# EasyEDA Pro project STM32空调遥控器.eprj, board PCB_V0.1.0
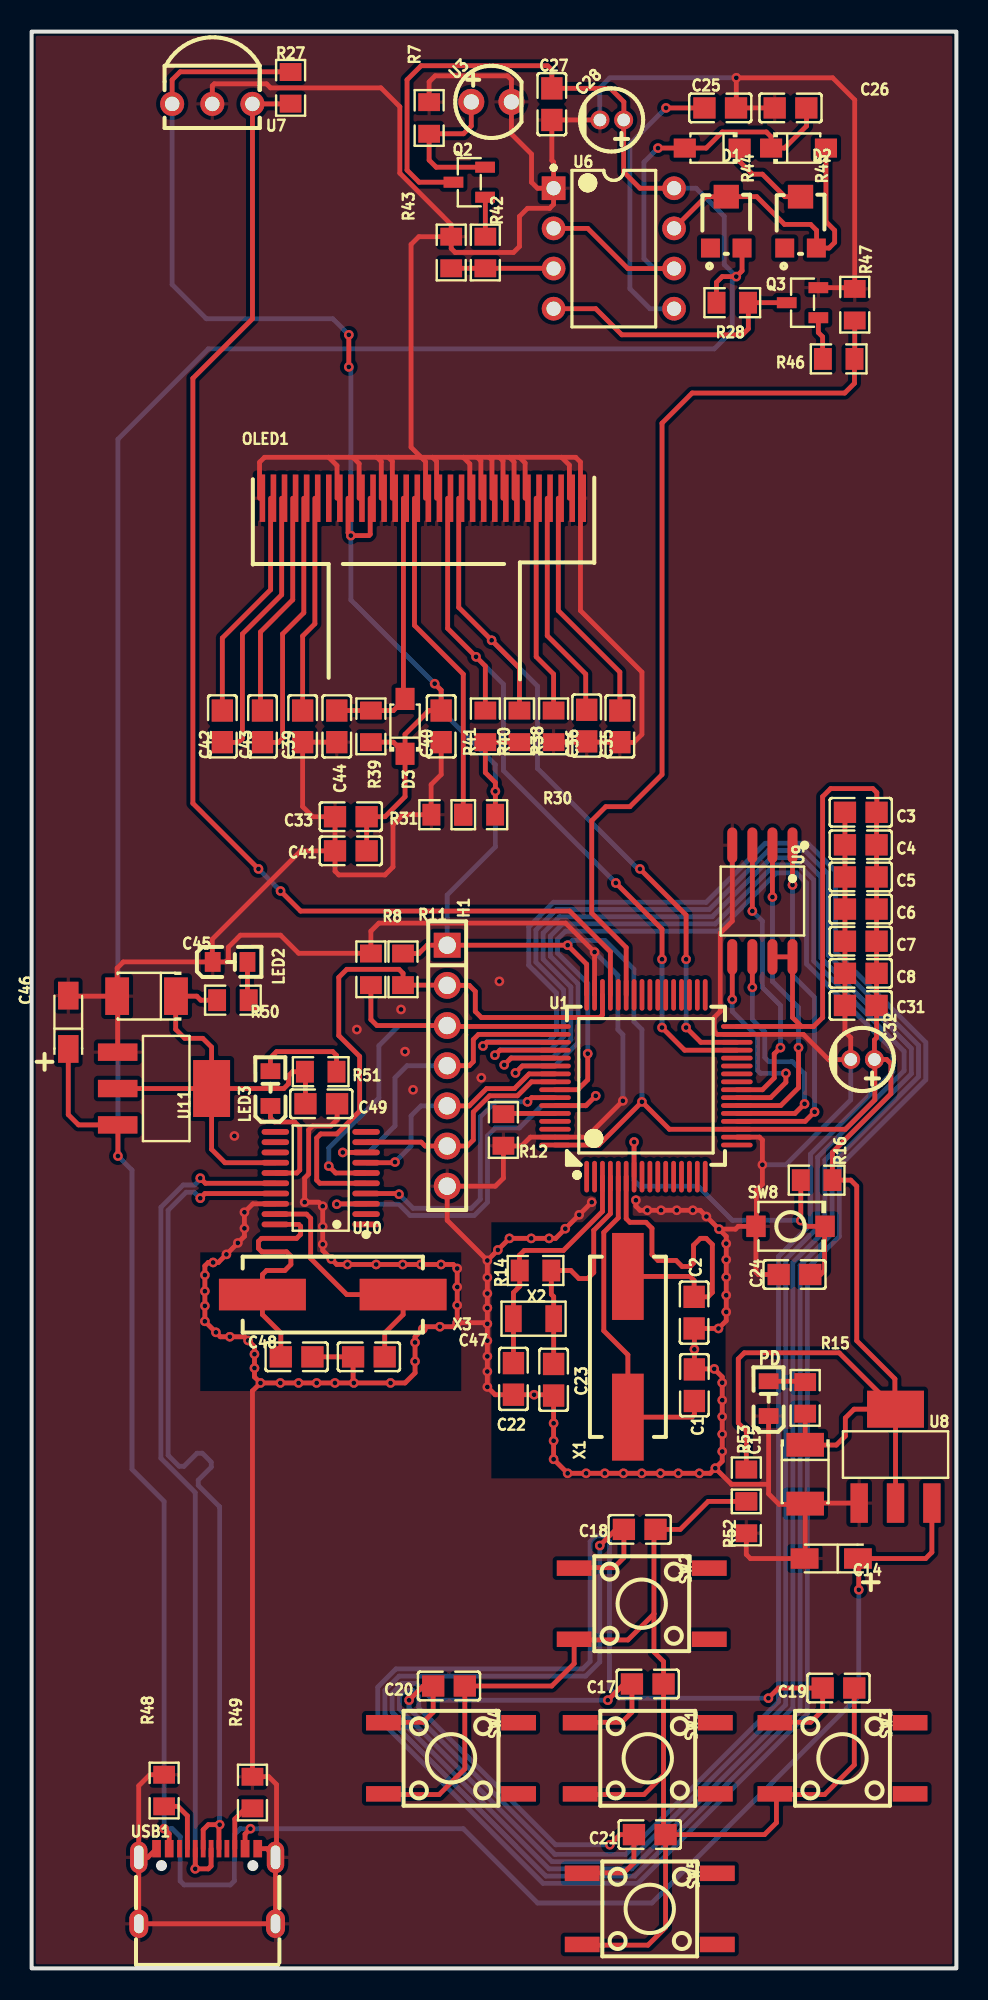
[diagram p5: board, top side]
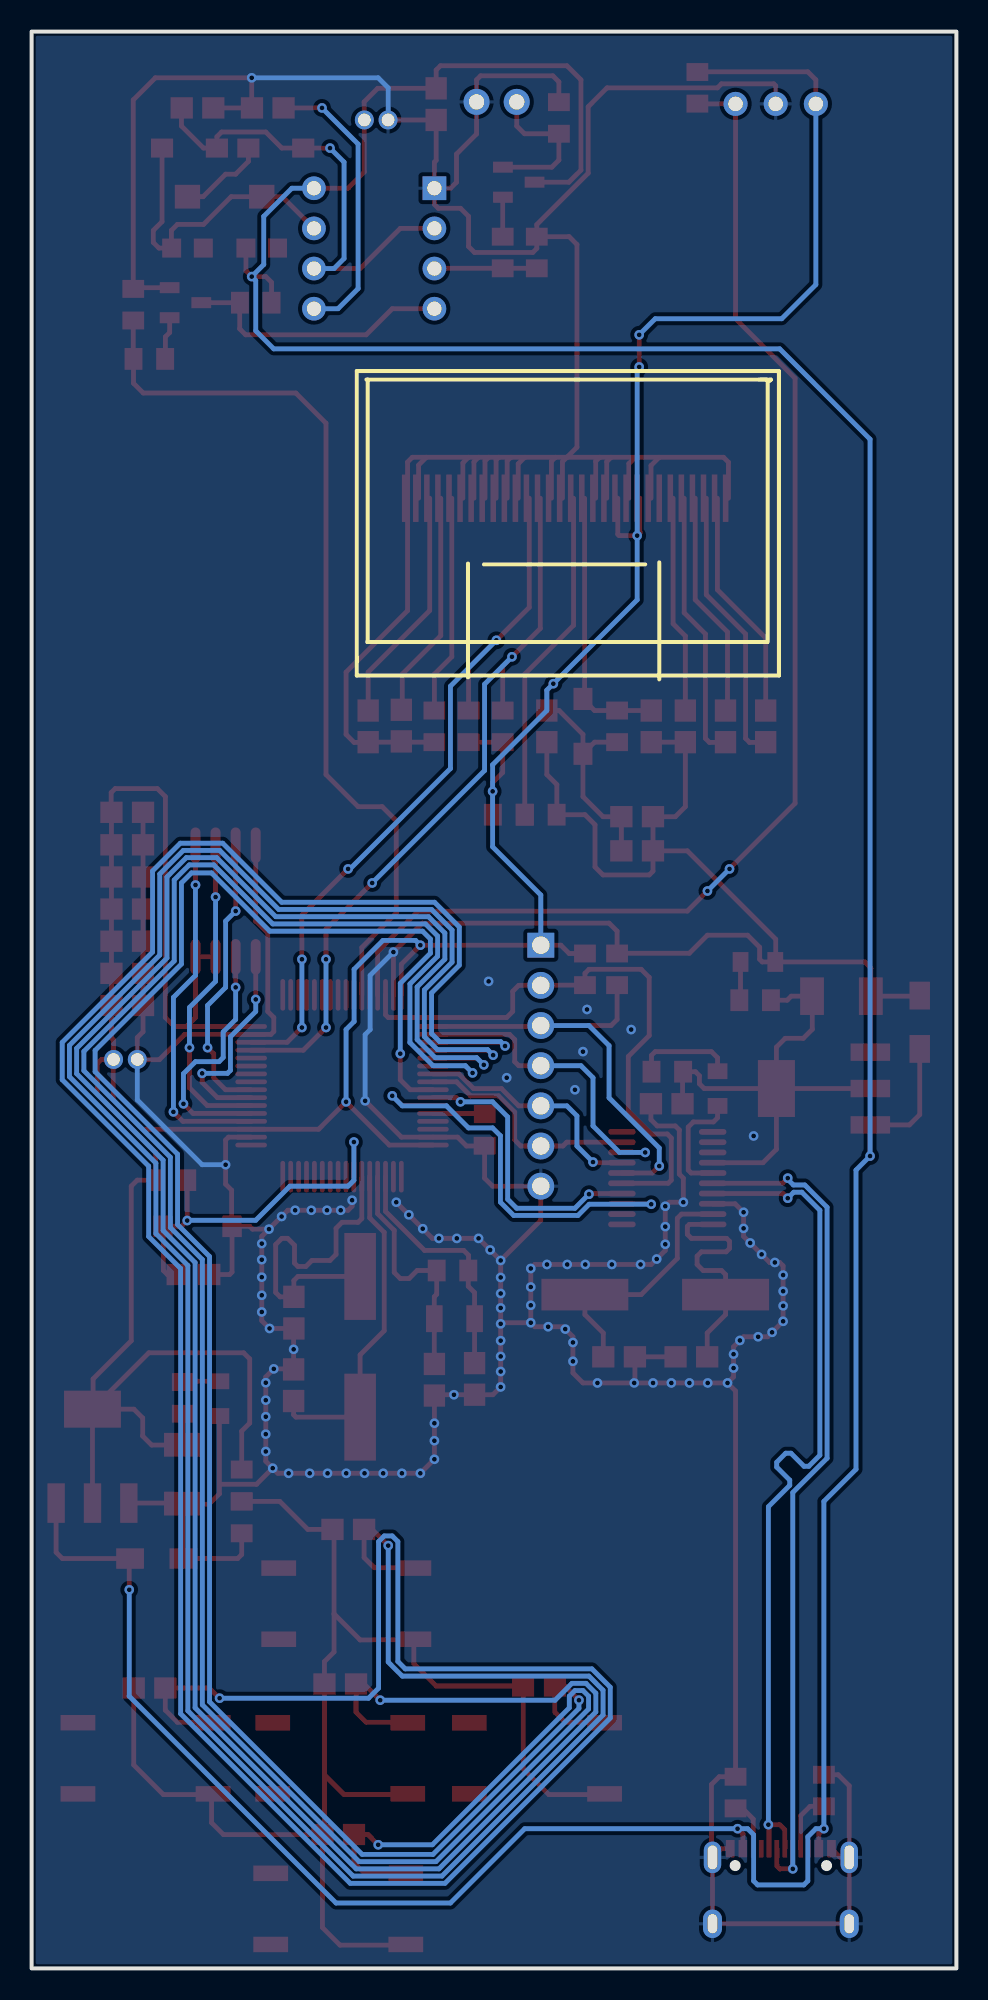
[diagram p6: board, bottom side, seen from below]

Outline 58.5 x 122.5 mm; copper layers: Top Layer, Bottom Layer. Coordinates in mm from the lower left corner of the outline.
Outline path: rectangle 0,122.5 58.5,0
Stack: Top Layer 0.035mm / Dielectric1 1.51mm FR4 er 4.5 / Bottom Layer 0.035mm

## Design rules (mm)
net OSC_IN: osc
net OSC_OUT: osc
net OSC32_IN: 32osc
net OSC32_OUT: 32osc
net XI: 347_osc
net XO: 347_osc
net D+: usb
net D-: usb
template: 自定义配置
spacing copperThickness1oz (default): track to track 0.152, other pairs 0.152 to 0.3
spacing copperThickness2oz: track to track 0.254, other pairs 0.152 to 0.3
track width copperThickness1oz (default): min 0.254, default 0.381, max 2.54
track width copperThickness2oz: min 0.203, default 0.254, max 2.54
differential pair differentialPair (default): width min 0.127, default 0.254, max 2.54; gap min 0.152, default 0.152
via viaSize (default): diameter min 0.5, default 0.61, max 10; hole min 0.3, default 0.305, max 6.299

## Placement (name value [footprint] x y rotation side)
C1  20pF  [C0805]  41.93 36.89 270 top
C2  20pF  [C0805]  41.91 41.47 90 top
C3  100nF  [C0805]  52.45 73.12 0 top
C4  100nF  [C0805]  52.45 71.06 0 top
C5  100nF  [C0805]  52.45 69.03 0 top
C6  100nF  [C0805]  52.45 67 0 top
C7  100nF  [C0805]  52.45 64.97 0 top
C8  4.7uF  [C0805]  52.45 62.94 0 top
C14  10uF  [CAP-SMD_L3.2-W1.6-RD-C7171]  50.59 25.92 180 top
C15  22uF  [CASE-B_3528]  48.93 31.26 270 top
C17  100uF  [C0805]  38.98 17.99 180 top
C18  100uF  [C0805]  38.47 27.77 180 top
C19  100uF  [C0805]  51.04 17.73 180 top
C20  100uF  [C0805]  26.4 17.86 180 top
C21  100uF  [C0805]  39.1 8.46 180 top
C22  12.5pF  [C0805]  30.48 37.28 90 top
C23  12.5pF  [C0805]  33.02 37.23 90 top
C24  100nF  [C0805]  48.26 43.89 0 top
C25  0.01μF  [C0805]  43.56 117.67 180 top
C26  10nF  [C0805]  48.01 117.67 0 top
C27  100nF  [C0805]  32.91 117.91 270 top
C28  10uF  [CAP-TH_BD4.0-P1.50-D0.8-FD]  36.7 116.91 180 top
C31  100nF  [C0805]  52.45 60.91 180 top
C32  10uF  [CAP-TH_BD4.0-P1.50-D0.8-FD]  52.57 57.49 180 top
C33  100nF  [C0805]  20.19 72.84 180 top
C35  2.2uF  [C0805]  37.21 78.56 90 top
C36  2.2uF  [C0805]  35.11 78.61 90 top
C39  1uF  [C0805]  17.14 78.56 90 top
C40  1uF  [C0805]  25.91 78.56 90 top
C41  10uF  [C0805]  20.19 70.68 180 top
C42  10uF  [C0805]  12.06 78.56 90 top
C43  10uF  [C0805]  14.61 78.56 90 top
C44  100nF  [C0805]  19.3 78.56 90 top
C45  22uF  [CASE-B_3528]  7.27 61.49 180 top
C46  10uF  [CAP-SMD_L3.2-W1.6-RD-C7171]  2.32 59.84 90 top
C47  20pF  [C0805]  21.34 38.68 0 top
C48  20pF  [C0805]  16.76 38.68 180 top
C49  100nF  [C0805]  18.32 54.69 0 top
D1  1N4007W  [SOD-123FL_L2.7-W1.8-LS3.8-RD]  43.05 115.13 180 top
D2  1N4007W  [SOD-123FL_L2.7-W1.8-LS3.8-RD]  48.51 115.13 0 top
D3  1N4004W  [SOD-123FL_L2.7-W1.8-LS3.8-RD]  23.62 78.56 90 top
H1  -  [HDR-TH_7P-P2.54-V-F]  26.29 57.09 270 top
LED1  -  [LED_0805]  46.63 36.09 90 top
LED2  -  [LED_0805]  12.61 63.65 0 top
LED3  -  [LED_0805]  15.11 55.7 90 top
OLED1  N096-2864KSWEG01-H30  [OLED_0.96-30P-P0.70-12864]  24.51 70.3 0 top
Q2  BSS138  [SOT-23-3_L2.9-W1.3-P1.90-LS2.4-BR]  27.69 112.97 0 top
Q3  BSS138  [SOT-23-3_L2.9-W1.3-P1.90-LS2.4-BR]  48.77 105.35 0 top
R7  165  [R0805]  25.15 117.04 270 top
R8  10K  [R0805]  21.46 63.19 90 top
R11  10K  [R0805]  23.49 63.19 90 top
R12  10K  [R0805]  29.84 53.03 270 top
R14  1M  [R0805]  31.88 44.14 180 top
R15  1.3K  [R0805]  48.93 36.08 270 top
R16  10K  [R0805]  49.66 49.86 0 top
R27  10K  [R0805]  16.38 118.94 90 top
R28  10K  [R0805]  44.32 105.35 180 top
R30  0  [R0805]  28.32 72.97 180 top
R31  0  [R0805]  26.29 72.97 0 top
R38  910K  [R0805]  33.02 78.56 90 top
R39  10K  [R0805]  21.46 78.56 270 top
R40  10K  [R0805]  30.86 78.56 270 top
R41  10K  [R0805]  28.7 78.56 270 top
R42  1M  [R0805]  28.7 108.53 270 top
R43  10K  [R0805]  26.54 108.53 90 top
R44  10kΩ  [RES-ADJ-SMD_3P-L3.0-W3.8-P1.75-BR]  43.94 110.44 270 top
R45  10kΩ  [RES-ADJ-SMD_3P-L3.0-W3.8-P1.75-BR]  48.64 110.44 270 top
R46  1M  [R0805]  51.05 101.8 0 top
R47  10K  [R0805]  52.07 105.23 270 top
R48  5.1K  [R0805]  8.38 11.25 270 top
R49  5.1K  [R0805]  13.97 11.12 270 top
R50  1.3K  [R0805]  12.73 61.24 180 top
R51  10K  [R0805]  18.29 56.71 180 top
R52  0  [R0805]  45.21 28.52 270 top
R53  0  [R0805]  45.21 30.55 90 top
SW1  K2-1102SP-C4SC-04  [KEY-SMD_4P-L6.0-W6.0-P4.50-LS9.5-BL]  38.98 13.29 270 top
SW2  K2-1102SP-C4SC-04  [KEY-SMD_4P-L6.0-W6.0-P4.50-LS9.5-BL]  38.59 23.07 270 top
SW3  K2-1102SP-C4SC-04  [KEY-SMD_4P-L6.0-W6.0-P4.50-LS9.5-BL]  51.3 13.29 270 top
SW4  K2-1102SP-C4SC-04  [KEY-SMD_4P-L6.0-W6.0-P4.50-LS9.5-BL]  26.53 13.29 270 top
SW5  K2-1102SP-C4SC-04  [KEY-SMD_4P-L6.0-W6.0-P4.50-LS9.5-BL]  39.1 3.76 270 top
SW8  TS-1088-AR02016  [SW-SMD_L3.9-W3.0-P4.45]  48.01 46.94 0 top
U1  STM32F103RCT6  [LQFP-64_L10.0-W10.0-P0.50-LS12.0-BL]  38.86 55.83 0 top
U3  MHL312IR039CRT  [LED-TH_BD4.2-P2.54-FD]  29.08 118.06 0 top
U6  NE555N  [DIP-8_L9.8-W6.6-P2.54-LS7.6-BL]  36.83 108.78 270 top
U7  HS0038BD  [OPTO-TH_3P-L6.0-W5.6-P2.54_TSOP14656]  11.43 117.93 180 top
U8  AMS1117-3.3  [SOT-223-3_L6.5-W3.4-P2.30-LS7.0-BR]  54.65 32.4 270 top
U9  W25Q64JVSSIQ  [SOIC-8_L5.3-W5.3-P1.27-LS8.0-BL]  46.23 67.51 180 top
U10  CH347T  [TSSOP-20_L6.5-W4.4-P0.65-LS6.4-BL]  18.29 49.98 90 top
U11  AMS1117-3.3  [SOT-223-3_L6.5-W3.4-P2.30-LS7.0-BR]  8.41 55.65 180 top
USB1  TYPE-C 16PIN 2MD(073)  [USB-C-SMD_TYPE-C-6PIN-2MD-073]  11.1 5.2 0 top
X1  8MHz  [CRYSTAL-SMD_L11.5-W4.8-LS12.7]  37.72 39.31 90 top
X2  32.768kHz  [OSC-SMD_L3.2-W1.5]  31.75 41.09 180 top
X3  8MHz  [CRYSTAL-SMD_L11.5-W4.8-LS12.7]  19.05 42.62 180 top

## Footprints (pads in the part's own frame, mm; a bottom-side part is the same pattern mirrored in y, then rotated)
C0805
  rect 1.41x1.35 smd: 1(-1,0) 2(1,0)
CAP-SMD_L3.2-W1.6-RD-C7171
  rect 1.758x1.296 smd: 1(-1.687,0) 2(1.687,0)
CAP-TH_BD4.0-P1.50-D0.8-FD
  round 1.2 hole 0.8: 1(-0.75,0) 2(0.75,0)
CASE-B_3528
  rect 1.506x2.376 smd: 1(-1.861,0) 2(1.861,0)
CRYSTAL-SMD_L11.5-W4.8-LS12.7
  rect 5.5x2 smd: 1(-4.45,0) 2(4.45,0)
DIP-8_L9.8-W6.6-P2.54-LS7.6-BL
  rect 1.5x1.5 hole 0.9: 1(-3.81,-3.81)
  round 1.5 hole 0.9: 2(-1.27,-3.81) 3(1.27,-3.81) 4(3.81,-3.81) 5(3.81,3.81) 6(1.27,3.81) 7(-1.27,3.81) 8(-3.81,3.81)
HDR-TH_7P-P2.54-V-F
  rect 1.575x1.7 hole 1.1: 1(-7.62,0)
  round 1.7 hole 1.1: 2(-5.08,0) 3(-2.54,0) 4(0,0) 5(2.54,0) 6(5.08,0) 7(7.62,0)
KEY-SMD_4P-L6.0-W6.0-P4.50-LS9.5-BL
  rect 0.98x2.2 smd: 1(-2.25,-4.275) 2(-2.25,4.275) 3(2.25,-4.275) 4(2.25,4.275)
LED-TH_BD4.2-P2.54-FD
  round 1.651 hole 0.965: 1(-1.27,0) 2(1.27,0)
LED_0805
  rect 1x1.25 smd: 1(-1.15,0.005) 2(1.05,0.005)
LQFP-64_L10.0-W10.0-P0.50-LS12.0-BL
  oval 0.3x2 smd: 1(-3.75,-5.75) 2(-3.25,-5.75) 3(-2.75,-5.75) 4(-2.25,-5.75) 5(-1.75,-5.75) 6(-1.25,-5.75) 7(-0.75,-5.75) 8(-0.25,-5.75) 9(0.25,-5.75) 10(0.75,-5.75) 11(1.25,-5.75) 12(1.75,-5.75) 13(2.25,-5.75) 14(2.75,-5.75) 15(3.25,-5.75) 16(3.75,-5.75) 33(3.75,5.75) 34(3.25,5.75) 35(2.75,5.75) 36(2.25,5.75) 37(1.75,5.75) 38(1.25,5.75) 39(0.75,5.75) 40(0.25,5.75) 41(-0.25,5.75) 42(-0.75,5.75) 43(-1.25,5.75) 44(-1.75,5.75) 45(-2.25,5.75) 46(-2.75,5.75) 47(-3.25,5.75) 48(-3.75,5.75)
  oval 2x0.3 smd: 17(5.75,-3.75) 18(5.75,-3.25) 19(5.75,-2.75) 20(5.75,-2.25) 21(5.75,-1.75) 22(5.75,-1.25) 23(5.75,-0.75) 24(5.75,-0.25) 25(5.75,0.25) 26(5.75,0.75) 27(5.75,1.25) 28(5.75,1.75) 29(5.75,2.25) 30(5.75,2.75) 31(5.75,3.25) 32(5.75,3.75) 49(-5.75,3.75) 50(-5.75,3.25) 51(-5.75,2.75) 52(-5.75,2.25) 53(-5.75,1.75) 54(-5.75,1.25) 55(-5.75,0.75) 56(-5.75,0.25) 57(-5.75,-0.25) 58(-5.75,-0.75) 59(-5.75,-1.25) 60(-5.75,-1.75) 61(-5.75,-2.25) 62(-5.75,-2.75) 63(-5.75,-3.25) 64(-5.75,-3.75)
OLED_0.96-30P-P0.70-12864
  rect 0.35x3 smd: 1(10.386,22.682) 2(9.687,22.684) 3(8.986,22.684) 4(8.287,22.684) 5(7.587,22.684) 6(6.886,22.684) 7(6.186,22.684) 8(5.487,22.684) 9(4.787,22.684) 10(4.086,22.684) 11(3.386,22.684) 12(2.687,22.684) 13(1.986,22.684) 14(1.286,22.684) 15(0.587,22.684) 16(-0.114,22.684) 17(-0.814,22.684) 18(-1.514,22.684) 19(-2.213,22.684) 20(-2.913,22.684) 21(-3.614,22.684) 22(-4.314,22.684) 23(-5.013,22.684) 24(-5.713,22.684) 25(-6.413,22.684) 26(-7.114,22.684) 27(-7.814,22.684) 28(-8.514,22.686) 29(-9.213,22.686) 30(-9.914,22.686)
OPTO-TH_3P-L6.0-W5.6-P2.54_TSOP14656
  round 1.524 hole 0.914: 1(-2.54,0) 2(0,0) 3(2.54,0)
OSC-SMD_L3.2-W1.5
  rect 1.05x1.7 smd: 1(-1.275,0) 2(1.275,0)
R0805
  rect 1.133x1.377 smd: 1(-1,0) 2(1,0)
RES-ADJ-SMD_3P-L3.0-W3.8-P1.75-BR
  rect 1.2x1.2 smd: 1(1.625,-1) 3(1.625,1)
  rect 1.5x1.6 smd: 2(-1.625,0)
SOD-123FL_L2.7-W1.8-LS3.8-RD
  rect 1.4x1.2 smd: 1(-1.735,0) 2(1.735,0)
SOIC-8_L5.3-W5.3-P1.27-LS8.0-BL
  oval 0.63x2.25 smd: 1(-1.905,-3.53) 2(-0.635,-3.53) 3(0.635,-3.53) 4(1.905,-3.53) 5(1.905,3.53) 6(0.635,3.53) 7(-0.635,3.53) 8(-1.905,3.53)
SOT-23-3_L2.9-W1.3-P1.90-LS2.4-BR
  rect 1.25x0.7 smd: 1(1,-0.95) 2(1,0.95) 3(-1,0)
SOT-223-3_L6.5-W3.4-P2.30-LS7.0-BR
  rect 2.5x1.1 smd: 1(2.97,-2.3) 2(2.97,0) 3(2.97,2.3)
  rect 2.34x3.6 smd: 4(-2.97,0)
SW-SMD_L3.9-W3.0-P4.45
  rect 1.23x1.36 smd: 1(-2.185,0) 2(2.185,0)
TSSOP-20_L6.5-W4.4-P0.65-LS6.4-BL
  oval 0.364x1.742 smd: 1(-2.925,-2.871) 2(-2.275,-2.871) 3(-1.625,-2.871) 4(-0.975,-2.871) 5(-0.325,-2.871) 6(0.325,-2.871) 7(0.975,-2.871) 8(1.625,-2.871) 9(2.275,-2.871) 10(2.925,-2.871) 11(2.925,2.871) 12(2.275,2.871) 13(1.625,2.871) 14(0.975,2.871) 15(0.325,2.871) 16(-0.325,2.871) 17(-0.975,2.871) 18(-1.625,2.871) 19(-2.275,2.871) 20(-2.925,2.871)
USB-C-SMD_TYPE-C-6PIN-2MD-073
  rect 0.55x1.1 smd: 1(-3.2,2.375) 2(-2.4,2.375) 11(2.4,2.375) 12(3.2,2.375)
  rect 0.3x1.1 smd: 3(-1.75,2.375) 4(-1.25,2.375) 5(-0.75,2.375) 6(-0.25,2.375) 7(0.25,2.375) 8(0.75,2.375) 9(1.25,2.375) 10(1.75,2.375)
  oval 1.1x2 hole 0.6x1.5: 13(-4.325,1.825) 14(4.325,1.825)
  oval 1.2x1.8 hole 0.6x1.2: 13(-4.325,-2.375) 14(4.325,-2.375)

## Nets
+5V: C14.1 C27.1 C28.1 C46.1 Q2.3 R28.2 R44.3 U6.8 U8.3 U11.3 USB1.2 USB1.11
GND: C1.1 C2.1 C3.1 C4.1 C5.1 C6.1 C7.1 C8.1 C14.2 C15.2 C22.1 C23.1 C24.1 C25.1 C26.1 C27.2 C28.2 C31.2 C32.2 C33.2 C35.1 C36.1 C39.1 C40.1 C41.2 C44.1 C45.2 C46.2 C47.1 C48.1 C49.2 H1.7 LED1.1 LED2.1 OLED1.1 OLED1.8 OLED1.10 OLED1.12 OLED1.13 OLED1.16 OLED1.17 OLED1.20 OLED1.21 OLED1.22 OLED1.23 OLED1.24 OLED1.25 OLED1.29 OLED1.30 Q3.2 R7.1 R8.2 R12.2 R31.1 R38.1 R43.2 R47.1 R48.1 R49.1 R52.2 SW8.1 U1.18 U1.31 U1.47 U1.63 U3.2 U6.1 U7.2 U8.1 U9.4 U10.18 U11.1 USB1.1 USB1.12 USB1.13 USB1.14
VCC: C3.2 C4.2 C5.2 C6.2 C7.2 C8.2 C15.1 C31.1 C32.1 C33.1 C40.2 C41.1 D3.1 H1.1 OLED1.9 OLED1.11 R11.2 R15.2 R16.2 R27.2 R30.1 R39.2 R40.2 R41.2 R53.2 U1.19 U1.32 U1.48 U1.64 U7.3 U8.2 U8.4 U9.7 U9.8
BOOT0: R12.1 U1.60
CH347T_3V3: C45.1 C49.1 R50.2 R51.2 U10.14 U11.2 U11.4
D+: U10.17 USB1.6 USB1.8
D-: U10.16 USB1.5 USB1.7
IR_CTL: R46.2 R47.2 U1.43
IR_IN: R27.1 U1.45 U7.1
IR_OUT: R42.2 R43.1 U6.3
JTDI: H1.4 U1.50 U10.8
JTDO: H1.5 U1.55 U10.7
JTRST: H1.6 U1.56 U10.9
KEY_1: C17.2 SW1.1 U1.53
KEY_2: C18.2 SW2.1 U1.52
KEY_3: C19.2 SW3.1 U1.51
KEY_4: C20.2 SW4.1 U1.57
KEY_5: C21.2 SW5.1 U1.54
NRST: C24.2 R16.1 SW8.2 U1.7
OLED_IREF: OLED1.26 R38.2
OLED_RES: C44.2 D3.2 OLED1.14 R39.1
OLED_SCL: OLED1.18 R41.1 U1.29
OLED_SDA: OLED1.19 R40.1 U1.30
OSC32_IN: C22.2 R14.2 U1.3 X2.2
OSC32_OUT: C23.2 R14.1 U1.4 X2.1
OSC_IN: C1.2 U1.5 X1.1
OSC_OUT: C2.2 U1.6 X1.2
RX: U1.59 U10.3
SPI_CLK: U1.21 U9.6
SPI_CS: U1.20 U9.1
SPI_DI: U1.23 U9.5
SPI_DO: U1.22 U9.2
SWCLK: H1.3 R8.1 U1.49 U10.6
SWDIO: H1.2 R11.1 U1.46 U10.5
TX: U1.58 U10.4
WP: U1.24 U9.3
XI: C47.2 U10.19 X3.1
XO: C48.2 U10.20 X3.2
$1N2657: C17.1 C18.1 C19.1 C20.1 C21.1 R52.1 R53.1 SW1.3 SW2.3 SW3.3 SW4.3 SW5.3
$1N5313: Q2.2 R7.2 U3.1
$1N6331: LED1.2 R15.1
$1N7061: Q3.3 R28.1 U6.4
$1N7750: C25.2 U6.5
$1N7809: C26.2 D1.2 D2.1 U6.2 U6.6
$1N7888: D2.2 R44.2 R45.3 U6.7
$1N9996: D1.1 R45.2
$1N16904: C35.2 OLED1.28
$1N16987: C36.2 OLED1.27
$1N17245: C39.2 OLED1.6
$1N17593: OLED1.15 R30.2 R31.2
$1N27947: C42.2 OLED1.2
$1N27951: C43.2 OLED1.4
$1N27956: C43.1 OLED1.5
$1N27972: C42.1 OLED1.3
$1N30536: Q2.1 R42.1
$1N30803: Q3.1 R46.1
$1N31656: LED2.2 R50.1
$1N31898: R48.2 USB1.4
$1N31900: R49.2 USB1.10
$1N32166: LED3.2 R51.1
$1N32261: LED3.1 U10.15

Pads without a net: OLED1 7; R44 1; R45 1; SW1 2 4; SW2 2 4; SW3 2 4; SW4 2 4; SW5 2 4; U1 1 2 8 9 10 11 12 13 14 15 16 17 25 26 27 28 33 34 35 36 37 38 39 40 41 42 44 61 62; U10 1 2 10 11 12 13; USB1 3 9

## Via types
v1: diameter 0.61, hole 0.305, Top Layer to Bottom Layer, 156 vias

## Routing (per net, layer and track width the routed paths; a pad name or vN(x,y) marks a point on that pad's centre or on a via; arc(x,y) is an arc through that point)
+5V: length 266.4
  Top Layer w0.305: v1(5.46,51.38) 5.46,53.33 U11.3 2.97,53.35 2.32,54 C46.1 ; v1(8.38,8.84) 8.7,8.51 USB1.2 ; R28.2 43.32,106.64 43.69,107.01 v1(44.58,107.01) 44.94,107.37 R44.3 ; v1(52.32,23.95) 52.32,25.87 C14.1 56.55,25.92 56.95,26.32 U8.3 ; USB1.11 13.5,8.5 v1(13.84,8.84) ; U6.8 38.48,112.59 37.45,113.62 C28.1 37.46,116.92 37.46,118.06 36.61,118.91 C27.1 32.91,120.07 32.64,120.34 24.64,120.34 23.75,119.45 23.75,113.74 24.51,112.97 Q2.3
  Bottom Layer w0.305: U6.8 42.04,112.59 43.81,110.82 43.81,107.77 v1(44.58,107.01) 44.32,106.75 44.32,103.58 43.18,102.43 11.18,102.43 5.46,96.72 v1(5.46,51.38) 6.35,50.49 6.35,31.57 8.38,29.54 v1(8.38,8.84) 8.89,8.84 9.4,8.33 9.4,5.53 9.65,5.28 12.57,5.28 12.83,5.53 12.83,8.45 13.21,8.84 v1(13.84,8.84) 27.3,8.84 32,4.14 39.24,4.14 52.32,17.22 v1(52.32,23.95)
GND: length 572.6
  Top Layer w0.305: 27.72,92.99 27.72,95.16 27.3,95.58 ; C15.2 48.97,29.43 U8.1 ; C15.2 48.93,25.96 C14.2 45.47,25.92 45.21,26.18 R52.2 ; C15.2 48.89,29.35 47.28,29.35 46.62,30.01 46.62,30.62 ; v1(26.92,40.84) 26.67,40.58 v1(25.83,40.58) 24.89,40.58 24.26,39.95 v1(24.26,39.59) v1(24.26,38.4) 24.26,37.66 23.62,37.03 v1(22.71,37.03) v1(20.38,37.03) ; v1(26.92,40.84) v1(26.92,41.94) v1(26.92,43.1) v1(26.92,44.27) 26.67,44.52 v1(25.9,44.52) v1(24.62,44.52) v1(23.48,44.52) v1(21.8,44.52) v1(19.98,44.52) 19.3,44.52 v1(18.96,44.87) 18.42,45.41 v1(18.42,45.8) v1(18.42,46.92) v1(18.42,48.2) 18.16,48.46 v1(17.27,48.46) 17.27,49.98 17.53,50.24 17.53,53.03 17.78,53.28 18.92,53.28 19.32,53.69 C49.2 ; v1(26.92,40.84) 28.76,40.84 v1(28.83,40.77) ; U6.1 33.02,111.58 32.77,111.32 31.37,111.32 30.86,110.82 30.86,108.91 30.48,108.53 26.8,108.53 26.54,108.78 R43.2 ; U6.1 33.02,114.25 32.91,114.36 C27.2 C28.2 ; U6.1 32,112.59 31.62,112.97 31.62,114.75 30.35,116.02 U3.2 30.35,119.45 30.1,119.71 25.53,119.71 25.15,119.33 R7.1 ; 24.92,92.99 24.92,95.3 24.64,95.58 ; 28.19,95.58 27.3,95.58 ; 28.19,95.58 28.96,95.58 ; 28.19,95.58 28.42,95.35 28.42,92.99 ; 27.3,95.58 25.36,95.58 ; v1(43.48,46.76) 44.53,46.76 44.7,46.94 SW8.1 ; v1(43.48,46.76) v1(42.69,47.56) 42.29,47.95 v1(41.83,47.95) v1(40.81,47.95) v1(39.82,47.95) v1(38.95,47.95) 38.48,47.95 38.23,48.2 v1(38.23,48.59) ; v1(43.48,46.76) 43.94,46.3 v1(43.94,45.84) v1(43.94,44.82) v1(43.94,43.72) v1(43.94,42.57) v1(43.94,41.52) 43.94,40.97 v1(43.45,40.47) C2.1 41.93,40.46 v1(41.93,39.16) C1.1 41.96,37.92 v1(43.18,37.92) 43.69,37.41 v1(43.69,37.04) v1(43.69,35.94) v1(43.69,34.89) v1(43.69,33.79) v1(43.69,32.69) 43.69,32.08 v1(43.25,31.64) ; 20.32,95.58 21.84,95.58 ; 20.32,95.58 20.72,95.18 20.72,92.99 ; 20.32,95.58 18.8,95.58 ; 21.84,95.58 22.56,95.58 ; 21.84,95.58 22.12,95.3 22.12,92.99 ; 30.86,95.58 30.23,95.58 ; 30.86,95.58 33.53,95.58 ; 30.86,95.58 31.22,95.22 31.22,92.99 ; 30.23,95.58 29.59,95.58 ; 30.23,95.58 30.52,95.28 30.52,92.99 ; Q3.2 51.99,106.31 R47.1 52.07,118.18 50.67,119.58 v1(44.58,119.58) 44.58,117.69 C25.1 C26.1 ; 29.82,92.99 29.82,95.35 29.59,95.58 ; 14.42,92.98 14.42,95.26 14.73,95.58 18.8,95.58 ; 33.53,95.58 34.02,95.08 34.02,92.99 ; 33.53,95.58 34.42,95.58 34.72,95.27 34.72,85.88 38.61,81.99 38.61,78.05 38.1,77.54 37.23,77.54 C35.1 R38.1 ; R43.2 24.49,109.53 24,109.04 24,96.21 24.64,95.58 ; R43.2 26.54,110.3 23.29,113.55 23.29,117.75 22.1,118.94 15.11,118.94 14.86,119.2 11.56,119.2 11.43,119.07 U7.2 ; LED1.1 46.62,30.62 ; 46.62,30.62 44.27,30.62 v1(43.25,31.64) ; U1.18 46.05,52.58 46.23,52.4 v1(46.23,50.83) 46.23,49.6 45.85,49.22 45.85,46.96 SW8.1 ; v1(14.48,37.03) v1(15.73,37.03) v1(16.89,37.03) v1(18.03,37.03) v1(19.19,37.03) v1(20.38,37.03) ; v1(14.48,37.03) 13.97,36.52 R49.1 15,12.12 15.49,11.63 15.49,7.09 USB1.14 ; v1(14.48,37.03) 14.1,37.41 v1(14.1,37.97) v1(14.1,38.85) 14.1,39.31 v1(13.7,39.72) 13.46,39.95 v1(12.54,39.95) 11.94,39.95 v1(11.66,40.23) v1(10.96,40.93) v1(10.96,41.9) v1(10.96,42.83) v1(10.96,43.85) 10.96,44.43 11.18,44.65 v1(11.48,44.65) 11.81,44.65 v1(12.32,45.16) v1(13.05,45.88) 13.46,46.3 v1(13.46,46.81) v1(13.46,47.82) 14,48.36 U10.18 ; 28.96,95.58 29.59,95.58 ; 28.96,95.58 29.12,95.41 29.12,92.99 ; v1(20.38,37.03) 20.34,37.08 C47.1 C48.1 ; C3.1 C4.1 C5.1 C6.1 C7.1 C8.1 C31.2 51.45,59.24 51.82,58.87 C32.2 51.8,57.48 50.42,57.48 48.82,59.08 U1.31 43.36,59.08 43.18,59.25 43.18,60.14 43.56,60.52 43.56,65.48 44.32,66.24 U9.4 ; USB1.1 7.35,7.02 USB1.13 ; 22.56,95.58 22.82,95.32 22.82,92.99 ; 22.56,95.58 24.64,95.58 ; LED2.1 12.28,63.66 12.45,63.83 12.45,64.59 13.21,65.35 15.75,65.35 16.89,64.21 21.45,64.21 R8.2 21.46,65.6 21.97,66.11 33.78,66.11 v1(35.61,64.28) U1.47 ; LED2.1 5.8,63.66 5.41,63.27 C45.2 ; LED2.1 11.43,63.68 11.43,65.1 17.02,70.68 C41.2 ; USB1.14 14.88,7.57 USB1.12 ; USB1.14 USB1.14 USB1.13 USB1.13 ; C41.2 19.19,69.4 19.43,69.16 22.35,69.16 22.86,69.67 22.86,72.33 23.49,72.97 R31.1 25.27,72.99 25.27,74.88 25.91,75.51 C40.1 ; C41.2 C33.2 17.78,72.84 17.14,73.48 C39.1 C44.1 ; USB1.13 6.78,11.55 7.48,12.25 R48.1 ; v1(28.83,40.77) v1(28.83,41.77) v1(28.83,42.69) v1(28.83,43.7) v1(28.83,44.78) ; v1(28.83,40.77) v1(28.83,39.7) v1(28.83,38.71) v1(28.83,37.75) v1(28.83,36.78) 29.32,36.28 C22.1 v1(31.78,36.28) 32.97,36.28 C23.1 v1(33.02,34.48) v1(33.02,33.37) v1(33.02,32.2) v1(33.91,31.31) v1(35.08,31.31) v1(36.26,31.31) v1(37.44,31.31) v1(38.6,31.31) v1(39.78,31.31) v1(40.91,31.31) v1(42.24,31.31) 42.93,31.31 v1(43.25,31.64) ; 18.8,95.58 19.32,95.05 19.32,92.99 ; v1(28.83,44.78) 26.29,47.32 H1.7 29.34,49.47 29.84,49.98 R12.2 29.86,52.02 30.99,52.02 31.55,52.58 U1.63 35.1,52.58 v1(37.4,54.87) ; v1(28.83,44.78) v1(29.49,45.44) v1(30.23,46.17) v1(31.61,46.17) v1(32.73,46.17) 33.15,46.17 v1(33.76,46.78) v1(34.64,47.66) v1(35.43,48.46) ; C24.1 45.97,43.89 45.82,44.04 SW8.1 ; C46.2 2.35,61.49 C45.2 ; C45.2 5.44,61.46 U11.1 ; 25.36,95.58 25.62,95.32 25.62,92.99 ; 25.36,95.58 24.64,95.58
  Bottom Layer w0.305: 35.56,64.33 37.08,62.81 37.08,59.38 37.4,59.06 v1(37.4,54.87) ; v1(44.58,119.58) 36.58,119.58 35.94,118.94 35.94,116.92 C28.2 ; v1(46.23,50.83) 47.71,50.83 51.82,54.94 C32.2
  vias: v1(12.83,52.65) v1(20.57,59.38) v1(23.37,60.65) v1(23.62,57.98) v1(24.13,55.57) v1(24.74,40.44) v1(28.45,56.33) v1(29.59,62.43)
VCC: length 266.6
  Top Layer w0.305: 49.47,59.58 50.04,60.14 ; 49.47,59.58 49.46,59.57 ; 49.47,59.58 49.34,59.58 49.34,59.57 49.34,59.58 48.7,59.58 ; 50.04,60.14 50.05,60.15 ; 50.04,60.14 50.04,74.11 50.55,74.62 53.21,74.62 53.47,74.37 53.47,73.14 C3.2 C4.2 C5.2 C6.2 C7.2 C8.2 C31.1 53.45,58.86 53.32,58.72 C32.1 ; v1(25.5,81.26) 25.91,80.84 C40.2 25.13,79.56 23.62,78.05 D3.1 ; C32.1 54.09,57.49 54.36,57.22 54.36,55.32 50.66,51.62 R16.2 51.82,49.86 52.2,49.47 52.2,39.7 54.61,37.28 54.61,35.41 ; C32.1 53.34,57.46 53.34,54.94 51.48,53.08 U1.19 40.34,53.08 v1(38.61,54.81) 35.87,52.08 U1.64 ; U8.4 52.03,35.37 51.48,34.81 51.48,33.67 50.9,33.1 48.95,33.1 C15.1 R15.2 ; U8.4 U8.2 ; U8.4 54.61,35.41 ; 54.61,35.41 51.09,38.93 45.08,38.93 44.7,38.55 44.7,34.49 45.21,33.98 R53.2 ; C41.1 C33.1 22.35,72.84 23.62,74.11 D3.1 ; 21.42,92.99 21.42,90.71 21.34,90.62 v1(20.19,90.62) 20.02,90.8 20.02,92.99 ; U1.48 35.11,63.51 v1(33.91,64.72) H1.1 25.02,64.72 24.49,64.19 R11.2 ; D3.1 22.89,77.56 R39.2 ; U7.3 8.89,119.45 9.4,119.96 16.37,119.96 R27.2 ; U9.7 U9.8 48.13,60.14 48.7,59.58 ; 48.7,59.58 U1.32 ; R30.1 29.34,72.99 v1(29.34,74.45) 29.34,75 28.7,75.64 R41.2 R40.2 ; v1(20.07,103.32) v1(20.07,101.29)
  Bottom Layer w0.305: v1(20.07,103.32) 19.05,104.34 11.05,104.34 8.89,106.5 U7.3 ; v1(38.61,54.81) 38.61,59.38 38.1,59.89 38.1,63.19 36.27,65.02 34.21,65.02 v1(33.91,64.72) ; v1(20.07,101.29) 20.19,101.16 v1(20.19,90.62) 20.19,86.56 v1(25.5,81.26) 25.91,80.84 C40.2 29.34,76.13 v1(29.34,74.45) 29.34,70.94 26.29,67.89 H1.1
BOOT0: length 3.3
  Top Layer w0.305: R12.1 29.89,54.08 U1.60
CH347T_3V3: length 33
  Top Layer w0.305: R50.2 10.7,61.24 10.45,61.49 C45.1 9.11,61.47 9.11,59.4 9.68,58.83 10.83,58.83 11.38,58.27 U11.4 ; C49.1 17.32,56.68 R51.2 16.51,56.71 16.26,56.46 16.26,55.95 15.95,55.65 U11.4 ; U11.4 11.38,51.81 12.23,50.96 U10.14 ; U11.4 U11.2
D+: length 54.4
  Top Layer w0.305: U10.17 10.96,49.01 v1(10.67,48.71) ; USB1.6 10.85,8.77 11.18,9.09 v1(11.89,9.09) 11.85,9.05 USB1.8
  Bottom Layer w0.305: v1(11.89,9.09) 11.89,29.2 10.54,30.55 10.54,30.88 11.37,31.71 11.37,32.01 10.8,32.58 10.46,32.58 9.64,31.76 9.33,31.76 8.64,32.46 8.64,47.95 9.78,49.09 10.29,49.09 v1(10.67,48.71)
D-: length 54.4
  Top Layer w0.305: v1(10.67,49.98) 10.99,49.66 U10.16 ; USB1.5 10.35,6.48 10.35,6.48 v1(10.35,6.29) 11.18,6.29 11.35,6.47 USB1.7
  Bottom Layer w0.305: v1(10.35,6.29) 10.35,30.1 8.18,32.27 8.18,48.14 9.59,49.55 10.31,49.55 10.67,49.91 v1(10.67,49.98)
IR_CTL: length 57
  Top Layer w0.305: R47.2 52.07,101.81 R46.2 52.05,100.26 51.43,99.64 41.78,99.64 39.88,97.73 39.88,75.51 37.85,73.48 36.32,73.48 35.43,72.59 35.43,66.75 37.61,64.57 U1.43
IR_IN: length 81.2
  Top Layer w0.305: v1(15.75,68.14) 17.02,66.87 34.04,66.87 36.61,64.3 U1.45 ; v1(14.35,69.54) 10.2,73.69 10.2,100.57 13.97,104.34 U7.1 16.37,117.93 R27.1
  Bottom Layer w0.305: v1(14.35,69.54) v1(15.75,68.14)
IR_OUT: length 6.5
  Top Layer w0.305: U6.3 33,107.53 R42.2 R43.1
JTDI: length 20.6
  Top Layer w0.305: U10.8 v1(19.68,51.61) ; U1.50 28.27,59.08 27.94,58.75 27.94,57.35 27.69,57.09 H1.4
  Bottom Layer w0.305: H1.4 23.75,57.09 22.99,56.33 22.99,53.28 21.31,51.61 v1(19.68,51.61)
JTDO: length 15.4
  Top Layer w0.305: U10.7 22.95,50.96 v1(22.99,51) ; 26.29,54.56 27.69,54.56 28.78,55.65 30.54,55.65 31.47,56.58 U1.55
  Bottom Layer w0.305: 26.29,54.56 24.64,54.56 24,53.92 24,52.02 v1(22.99,51)
JTRST: length 14.8
  Top Layer w0.305: U10.9 24.65,52.26 24.89,52.02 H1.6 27.56,52.02 27.94,52.4 27.94,54.16 28.97,55.19 30.73,55.19 31.62,56.08 U1.56
KEY_1: length 150.3
  Top Layer w0.305: SW1.1 34.73,15.57 37.34,15.57 37.98,16.2 C17.2 37.47,17.99 v1(36.45,16.96) ; U1.53 30.32,57.58 v1(29.89,57.15)
  Bottom Layer w0.305: v1(36.45,16.96) 25.39,16.96 24.32,18.03 23.43,18.03 22.81,17.41 22.81,16.22 32.73,6.29 37.97,6.29 48.16,16.48 48.16,44.65 50.18,46.67 50.18,51.12 55.65,56.59 55.65,58.19 49.94,63.9 49.94,69.03 48.71,70.25 46.79,70.25 43.05,66.52 33.39,66.52 32.36,65.49 32.36,63.83 34.11,62.08 34.11,58.75 32.97,57.6 30.35,57.6 v1(29.89,57.15)
KEY_2: length 161.1
  Top Layer w0.305: v1(35.94,26.74) 36.96,27.77 C18.2 37.47,25.98 36.83,25.34 34.35,25.34 34.32,25.32 ; U1.52 29.62,58.08 v1(29.31,57.76)
  Bottom Layer w0.305: v1(35.94,26.74) 35.94,19.38 35.05,18.49 23.24,18.49 22.35,17.59 22.35,16.03 32.54,5.84 38.16,5.84 48.62,16.29 48.62,44.46 50.64,46.48 50.64,50.93 56.11,56.4 56.11,58.38 50.39,64.09 50.39,69.22 48.9,70.71 46.6,70.71 42.87,66.98 33.2,66.98 31.9,65.68 31.9,63.64 33.65,61.89 33.65,58.94 32.83,58.11 29.66,58.11 v1(29.31,57.76)
KEY_3: length 187.3
  Top Layer w0.305: v1(28.55,58.34) 28.79,58.58 U1.51 ; v1(46.61,17.09) 47.25,17.73 C19.2 50.04,16.33 49.28,15.57 47.05,15.57 SW3.1
  Bottom Layer w0.305: v1(28.55,58.34) 28.83,58.62 32.69,58.62 33.2,59.13 33.2,61.7 31.45,63.45 31.45,65.86 33.01,67.43 42.68,67.43 46.41,71.17 49.09,71.17 50.85,69.41 50.85,64.28 56.57,58.57 56.57,56.21 51.1,50.74 51.1,46.29 49.07,44.27 49.07,16.1 38.35,5.38 32.35,5.38 21.89,15.84 21.89,17.78 23.06,18.94 34.86,18.94 35.33,19.41 35.33,26.99 35.69,27.35 36.19,27.35 36.55,26.99 36.55,17.72 37.18,17.09 v1(46.61,17.09)
KEY_4: length 125.5
  Top Layer w0.305: U1.57 34.55,55.58 35.18,56.21 v1(35.18,57.86) ; v1(23.88,16.96) 24.77,17.86 C20.2 25.4,16.2 24.77,15.57 22.28,15.57 SW4.1
  Bottom Layer w0.305: v1(35.18,57.86) 35.18,62.3 33.27,64.21 33.27,65.11 33.77,65.6 43.43,65.6 47.12,69.29 48.39,69.29 49.02,68.65 49.02,63.53 54.48,58.06 54.48,56.71 49.27,51.5 49.27,47.05 47.24,45.02 47.24,16.86 37.59,7.21 33.11,7.21 23.88,16.44 v1(23.88,16.96)
KEY_5: length 149.9
  Top Layer w0.305: SW5.1 34.86,6.04 37.46,6.04 38.1,6.68 C21.2 37.22,8.46 v1(36.58,7.82) ; v1(30.61,56.64) 31.04,57.08 U1.54
  Bottom Layer w0.305: v1(36.58,7.82) 33.15,7.82 24.49,16.48 24.49,17.22 24.13,17.57 23.62,17.57 23.27,17.22 23.27,16.41 32.92,6.75 37.78,6.75 47.7,16.67 47.7,44.83 49.72,46.86 49.72,51.31 55.19,56.78 55.19,58 49.48,63.72 49.48,68.84 48.53,69.8 46.98,69.8 43.24,66.06 33.58,66.06 32.82,65.3 32.82,64.02 34.57,62.27 34.57,58.56 33.11,57.09 31.06,57.09 v1(30.61,56.64)
NRST: length 24.3
  Top Layer w0.305: R16.1 v1(48.66,47.3) 49.02,46.94 SW8.2 50.17,46.91 50.17,44.14 49.91,43.89 C24.2 ; U1.7 v1(38.11,52.27)
  Bottom Layer w0.305: v1(48.66,47.3) 48.64,47.32 44.32,47.32 42.16,49.47 38.48,49.47 38.11,49.84 v1(38.11,52.27)
OLED_IREF: length 13.9
  Top Layer w0.305: R38.2 33.02,81.86 31.92,82.96 31.92,92.99
OLED_RES: length 17.4
  Top Layer w0.305: 23.52,92.99 23.52,80.4 D3.2 22.89,79.56 R39.1 C44.2
OLED_SCL: length 48.1
  Top Layer w0.305: v1(36.96,68.65) 39.88,65.73 v1(39.88,63.83) ; v1(39.88,59.51) 41.31,58.08 U1.29 ; R41.1 28.7,82.37 v1(28.11,82.96) 26.32,84.75 26.32,92.99
  Bottom Layer w0.305: v1(36.96,68.65) 29.84,75.76 29.84,81.22 v1(28.11,82.96) ; v1(39.88,59.51) v1(39.88,63.83)
OLED_SDA: length 48.3
  Top Layer w0.305: v1(38.48,69.54) 41.4,66.62 v1(41.4,63.83) ; R40.1 30.86,82.24 v1(29.1,84) 27.02,86.08 27.02,92.99 ; U1.30 42.33,58.58 v1(41.4,59.51)
  Bottom Layer w0.305: v1(41.4,59.51) v1(41.4,63.83) ; v1(38.48,69.54) 38.35,69.54 32,75.89 32,81.1 v1(29.1,84)
OSC32_IN: length 15.6
  Top Layer w0.305: U1.3 36.11,47.88 33.64,45.41 31.17,45.41 30.86,45.11 30.86,44.16 R14.2 30.88,43.14 30.48,42.74 30.48,41.1 X2.2 30.48,41.09 C22.2
OSC32_OUT: length 15.5
  Top Layer w0.305: U1.4 36.61,47.73 35.56,46.68 35.56,44.01 35.18,43.63 34.62,43.63 34.11,44.14 R14.1 32.88,42.63 33.02,42.48 X2.1 33.02,38.23 C23.2
OSC_IN: length 21.4
  Top Layer w0.305: U1.5 37.11,47.47 36.2,46.55 36.2,40.33 37.72,38.81 X1.1 41.78,34.86 41.93,35.01 C1.2
OSC_OUT: length 21.5
  Top Layer w0.305: X1.2 41.65,43.77 41.91,43.51 C2.2 42.78,42.47 43.06,42.75 43.06,45.78 42.67,46.17 42.3,46.17 41.87,45.74 41.87,44.61 41.66,44.39 41.15,44.39 40.77,44.78 39.62,44.78 39.24,45.16 39.24,46.81 38.86,47.19 37.85,47.19 37.61,47.42 U1.6
RX: length 27
  Top Layer w0.305: v1(35.69,55.19) 35.07,54.58 U1.59 ; U10.3 19.33,48.36 v1(19.3,48.33)
  Bottom Layer w0.305: v1(35.69,55.19) 35.05,54.56 32.26,54.56 30.86,53.16 29.34,53.16 28.84,52.66 28.84,48.46 28,47.62 23.94,47.62 23.23,48.33 v1(19.3,48.33)
SPI_CLK: length 16.1
  Top Layer w0.305: U9.6 v1(45.59,62.05) ; v1(48.89,54.68) 48.29,54.08 U1.21
  Bottom Layer w0.305: v1(48.89,54.68) 48.89,56.59 48.13,57.35 46.64,57.35 46.38,57.61 46.38,59.23 45.59,60.02 v1(45.59,62.05)
SPI_CS: length 22.6
  Top Layer w0.305: U1.20 48.93,53.58 v1(49.53,54.17) ; U9.1 v1(48.13,68.53)
  Bottom Layer w0.305: v1(48.13,68.53) 48.13,62.81 49.53,61.41 v1(49.53,54.17)
SPI_DI: length 13.8
  Top Layer w0.305: v1(47.71,56.61) 47.71,56.04 46.75,55.08 U1.23 ; U9.5 v1(44.32,61.29)
  Bottom Layer w0.305: v1(44.32,61.29) 44.32,60.52 45.92,58.92 45.92,56.8 46.11,56.61 v1(47.71,56.61)
SPI_DO: length 20.4
  Top Layer w0.305: U1.22 47.39,54.58 48.51,55.7 v1(48.51,58.24) ; U9.2 v1(46.86,67.76)
  Bottom Layer w0.305: v1(48.51,58.24) 48.51,60.78 46.86,62.43 v1(46.86,67.76)
SWCLK: length 30.3
  Top Layer w0.305: R8.1 21.46,60.02 21.84,59.64 H1.3 26.35,59.58 U1.49 ; U10.6 19.23,50.31 v1(18.8,50.75)
  Bottom Layer w0.305: v1(18.8,50.75) 18.8,51.89 21.97,55.06 21.97,58.36 23.24,59.64 H1.3
SWDIO: length 39
  Top Layer w0.305: U1.46 36.11,60.31 35.94,60.14 28.45,60.14 28.07,60.52 28.07,61.79 27.69,62.17 H1.2 26.27,62.19 R11.1 23.49,62.94 23.24,63.19 19.94,63.19 19.43,62.68 19.43,59 20.75,57.68 20.75,54.22 19.3,52.78 18.29,52.78 18.03,52.52 18.03,49.86 18.23,49.66 U10.5
TX: length 18.3
  Top Layer w0.305: U1.58 31.64,55.08 v1(31.37,54.81) ; U10.4 23.2,49.01 v1(23.24,48.97)
  Bottom Layer w0.305: v1(23.24,48.97) 24.13,48.08 27.81,48.08 28.38,48.65 28.38,53.86 29.34,54.81 v1(31.37,54.81)
WP: length 18.3
  Top Layer w0.305: U9.3 v1(45.59,66.87) ; v1(47.37,58.24) 46.98,57.84 46.98,56.32 46.23,55.58 U1.24
  Bottom Layer w0.305: v1(45.59,66.87) 46.23,66.24 46.23,62.05 47.37,60.91 v1(47.37,58.24)
XI: length 16.1
  Top Layer w0.305: U10.19 17.39,47.71 17.65,47.44 17.65,44.9 19.94,42.62 X3.1 23.5,41.35 22.34,40.19 C47.2
XO: length 16
  Top Layer w0.305: U10.20 16.89,47.06 17.02,46.94 17.02,46.43 16.76,46.17 14.54,46.17 14.35,45.99 14.35,45.54 14.57,45.32 16.13,45.32 16.4,45.05 16.4,44.52 16.02,44.14 14.86,44.14 14.6,43.88 X3.2 14.6,41.35 15.76,40.19 C48.2
$1N2657: length 89.3
  Top Layer w0.305: 47.06,10.99 47.12,10.94 47.12,9.22 46.36,8.46 C21.1 ; 47.06,10.99 50.17,10.99 52.04,12.87 C19.1 ; 47.06,10.99 47.02,11.04 ; 39.37,22.42 37.72,20.77 34.36,20.77 34.32,20.82 34.32,19.28 32.9,17.86 C20.1 27.4,12.62 25.78,10.99 22.3,10.99 22.25,11.04 ; 39.37,22.42 39.37,27.67 C18.1 41.03,27.77 42.8,29.54 45.2,29.54 R52.1 ; 39.37,22.42 39.37,20.01 39.98,19.41 C17.1 39.98,12.24 ; C21.1 39.98,8.46 39.98,12.24 ; C21.1 40.1,2.58 38.99,1.47 34.87,1.47 SW5.3 ; 34.7,11.04 34.74,10.99 38.73,10.99 39.98,12.24
$1N5313: length 9.8
  Top Layer w0.305: U3.1 27.81,116.53 27.32,116.04 R7.2 25.15,114.37 25.59,113.92 28.69,113.92
$1N6331: length 2.3
  Top Layer w0.305: LED1.2 48.88,37.14 R15.1
$1N7061: length 17.3
  Top Layer w0.305: U6.4 35.69,104.97 37.34,103.32 44.96,103.32 45.34,103.7 45.34,105.34 R28.1 Q3.3
$1N7750: length 18.1
  Top Layer w0.305: C25.2 v1(40.13,117.67)
  Bottom Layer w0.305: U6.5 39.12,104.97 37.85,106.24 37.85,115.39 v1(40.13,117.67)
$1N7809: length 30.6
  Top Layer w0.305: U6.6 37.72,107.51 35.18,110.05 U6.2 ; C26.2 49.02,117.66 49.02,116.53 47.62,115.13 D2.1 46.78,115.85 46.48,116.15 43.69,116.15 42.67,115.13 D1.2 v1(39.62,115.13)
  Bottom Layer w0.305: U6.6 39.37,107.51 38.73,108.15 38.73,114.25 v1(39.62,115.13)
$1N7888: length 19.4
  Top Layer w0.305: U6.7 42.65,112.06 R44.2 45.87,112.06 47.62,110.31 49.28,110.31 49.66,109.93 49.66,108.83 R45.3 50.45,108.81 50.8,109.16 50.8,109.93 50.25,110.48 D2.2
$1N9996: length 5.6
  Top Layer w0.305: R45.2 47.65,112.06 46.23,113.48 45.59,113.48 44.79,114.29 D1.1
$1N16904: length 15
  Top Layer w0.305: 33.32,92.99 33.32,85.88 37.21,81.99 C35.2
$1N16987: length 14.4
  Top Layer w0.305: 32.62,92.99 32.62,84.29 35.05,81.86 35.05,79.67 C36.2
$1N17245: length 13.7
  Top Layer w0.305: 17.92,92.99 17.92,85.05 17.14,84.27 C39.2
$1N17593: length 21.4
  Top Layer w0.305: 24.22,92.99 24.22,84.95 27.3,81.86 27.3,73.11 27.45,72.97
$1N27947: length 14.7
  Top Layer w0.305: 15.12,92.99 15.12,87.2 12.06,84.15 C42.2
$1N27951: length 14.3
  Top Layer w0.305: 16.52,92.99 16.52,86.57 14.48,84.53 14.48,79.69 C43.2
$1N27956: length 17.1
  Top Layer w0.305: 17.22,92.99 17.22,85.74 15.87,84.4 15.87,77.8 15.62,77.54 14.62,77.54 C43.1
$1N27972: length 17.6
  Top Layer w0.305: 15.82,92.99 15.82,86.88 13.33,84.4 13.33,77.8 13.08,77.54 12.08,77.54 C42.1
$1N30536: length 2.5
  Top Layer w0.305: R42.1 28.7,112.01 Q2.1
$1N30803: length 2.7
  Top Layer w0.305: Q3.1 49.77,103.47 50.04,103.2 50.04,101.81 R46.1
$1N31656: length 2.5
  Top Layer w0.305: LED2.2 13.66,61.32 R50.1
$1N31898: length 3.8
  Top Layer w0.305: R48.2 9.25,10.25 9.85,9.65 USB1.4
$1N31900: length 3.3
  Top Layer w0.305: USB1.10 12.85,9.45 13.53,10.12 R49.2
$1N32166: length 6.3
  Top Layer w0.305: LED3.2 15.11,57.6 15.49,57.98 19.05,57.98 19.29,57.75 R51.1
$1N32261: length 7.2
  Top Layer w0.305: LED3.1 15.11,53.8 15.37,53.54 16.64,53.54 16.96,53.21 16.96,50.49 16.78,50.31 U10.15

## Copper pours and planes (outline as drawn; the poured copper is in the pictures)
GND on Top Layer: 0,122.5 58.5,122.5 58.5,0 0,0
GND on Bottom Layer: 0,122.5 58.5,122.5 58.5,0 0,0

## Text on the board
Top Silkscreen Layer: PD
